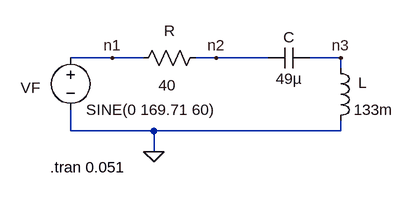
[diagram p0: schematic circuito3.asc]
circuito3.asc, the LTspice schematic file:
Version 4
SHEET 1 880 680
WIRE 112 96 48 96
WIRE 160 96 112 96
WIRE 272 96 240 96
WIRE 352 96 272 96
WIRE 464 96 416 96
WIRE 464 112 464 96
WIRE 48 208 48 176
WIRE 176 208 48 208
WIRE 464 208 464 192
WIRE 464 208 176 208
WIRE 176 240 176 208
FLAG 176 240 0
FLAG 112 96 n1
FLAG 272 96 n2
FLAG 464 96 n3
SYMBOL voltage 48 80 R0
WINDOW 0 -77 62 Left 2
WINDOW 123 0 0 Left 0
WINDOW 39 0 0 Left 0
SYMATTR InstName VF
SYMATTR Value SINE(0 169.71 60)
SYMBOL res 144 112 R270
WINDOW 0 42 56 VTop 2
WINDOW 3 -10 53 VBottom 2
SYMATTR InstName R
SYMATTR Value 40
SYMBOL ind 448 96 R0
WINDOW 0 43 38 Left 2
SYMATTR InstName L
SYMATTR Value 133m
SYMBOL cap 352 112 R270
WINDOW 0 32 32 VTop 2
WINDOW 3 0 32 VBottom 2
SYMATTR InstName C
SYMATTR Value 49µ
TEXT 16 264 Left 2 !.tran 0.051

The netlist it stands for:
* circuito3.asc
VF n1 0 SINE(0 169.71 60)
R n1 n2 40
L n3 0 133m
C n2 n3 49µ
.tran 0.051
.backanno
.end

* Results of the author's LTspice run, read from the files saved beside the schematic
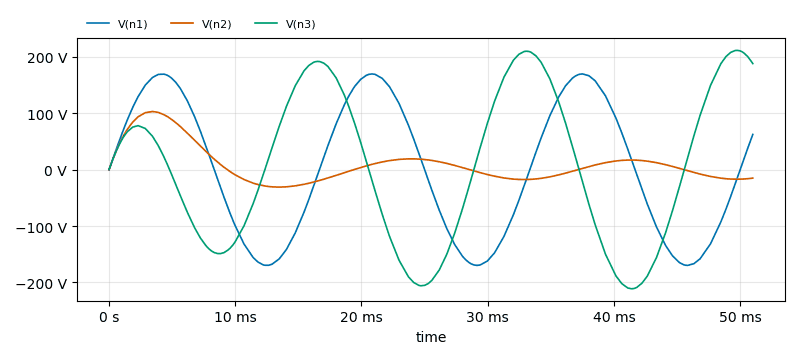
[diagram p1: Transient Analysis of circuito3.asc, plotted from the saved traces]
* Transient Analysis, 1 run:
*   V(n1): min -169.7 V, max 169.7 V, average 647.7 mV, rms 118.9 V, last 62.47 V
*   V(n2): min -30.93 V, max 103.1 V, average 8.409 V, rms 33.29 V, last -15 V
*   V(n3): min -211.2 V, max 211.5 V, average 5.033 V, rms 135.8 V, last 188 V